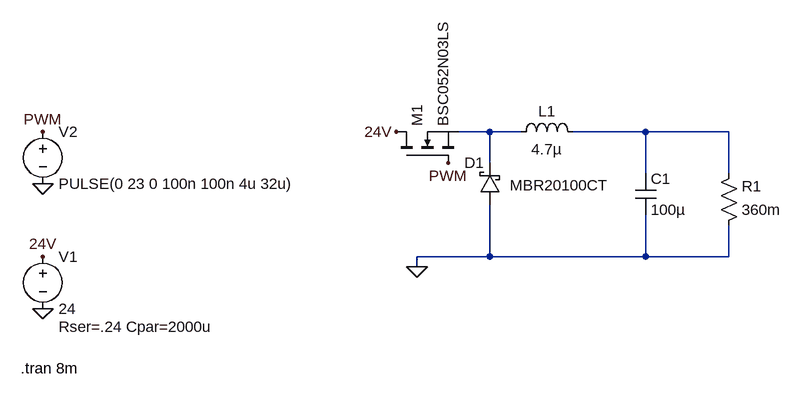
[diagram p0: schematic current limiter.asc]
current limiter.asc, the LTspice schematic file:
Version 4
SHEET 1 1368 680
WIRE 720 -48 672 -48
WIRE 768 -48 720 -48
WIRE 960 -48 848 -48
WIRE 1088 -48 960 -48
WIRE 720 0 720 -48
WIRE 960 16 960 -48
WIRE 1088 16 1088 -48
WIRE 720 144 720 64
WIRE 720 144 608 144
WIRE 960 144 960 80
WIRE 960 144 720 144
WIRE 1088 144 1088 96
WIRE 1088 144 960 144
WIRE 608 160 608 144
FLAG 32 224 0
FLAG 32 144 24V
FLAG 608 160 0
FLAG 576 -48 24V
FLAG 656 0 PWM
FLAG 32 -48 PWM
FLAG 32 32 0
SYMBOL voltage 32 128 R0
WINDOW 123 0 0 Left 0
WINDOW 39 24 124 Left 2
SYMATTR InstName V1
SYMATTR Value 24
SYMATTR SpiceLine Rser=.24 Cpar=2000u
SYMBOL res 1072 112 M180
WINDOW 0 36 76 Left 2
WINDOW 3 36 40 Left 2
SYMATTR InstName R1
SYMATTR Value 360m
SYMBOL voltage 32 -64 R0
WINDOW 123 0 0 Left 0
WINDOW 39 24 124 Left 2
SYMATTR InstName V2
SYMATTR Value PULSE(0 23 0 100n 100n 4u 32u)
SYMBOL ind 752 -32 R270
WINDOW 0 32 56 VTop 2
WINDOW 3 5 56 VBottom 2
SYMATTR InstName L1
SYMATTR Value 4.7µ
SYMATTR SpiceLine Ipk=5.9 Rser=0.01 Rpar=0 Cpar=0 mfg="Murata" pn="MDH10060C-4R7NA=P3"
SYMBOL schottky 736 64 R180
WINDOW 0 24 64 Left 2
WINDOW 3 -168 30 Left 2
SYMATTR InstName D1
SYMATTR Value MBR20100CT
SYMATTR Description Diode
SYMATTR Type diode
SYMBOL cap 944 16 R0
SYMATTR InstName C1
SYMATTR Value 100µ
SYMBOL nmos 576 0 R270
SYMATTR InstName M1
SYMATTR Value BSC052N03LS
TEXT -2 316 Left 2 !.tran 8m

The netlist it stands for:
* current limiter.asc
V1 24V 0 24 Rser=.24 Cpar=2000u
R1 0 N002 360m
V2 PWM 0 PULSE(0 23 0 100n 100n 4u 32u)
L1 N001 N002 4.7µ Ipk=5.9 Rser=0.01 Rpar=0 Cpar=0 mfg="Murata" pn="MDH10060C-4R7NA=P3"
D1 0 N001 MBR20100CT
C1 N002 0 100µ
M1 24V PWM N001 N001 BSC052N03LS
.model D D
.lib standard.dio
.model NMOS NMOS
.model PMOS PMOS
.lib standard.mos
.tran 8m
.backanno
.end